# Altium project SVPXFMC_Carrier_6U.PrjPcb (part 6 of 9)

## Sheet CAN_IFC.SchDoc
size A3; Organization: Altium Limited; Address1: L3, 12a Rodborough Rd; Address2: Frenchs Forest; Address3: NSW; Address4: Australia 2086
Used 2 times, as channels FMC Carrier Channel1/U_CAN_IFC, FMC Carrier Channel2/U_CAN_IFC. Parts and nets are listed once, with the designators drawn on the sheet.
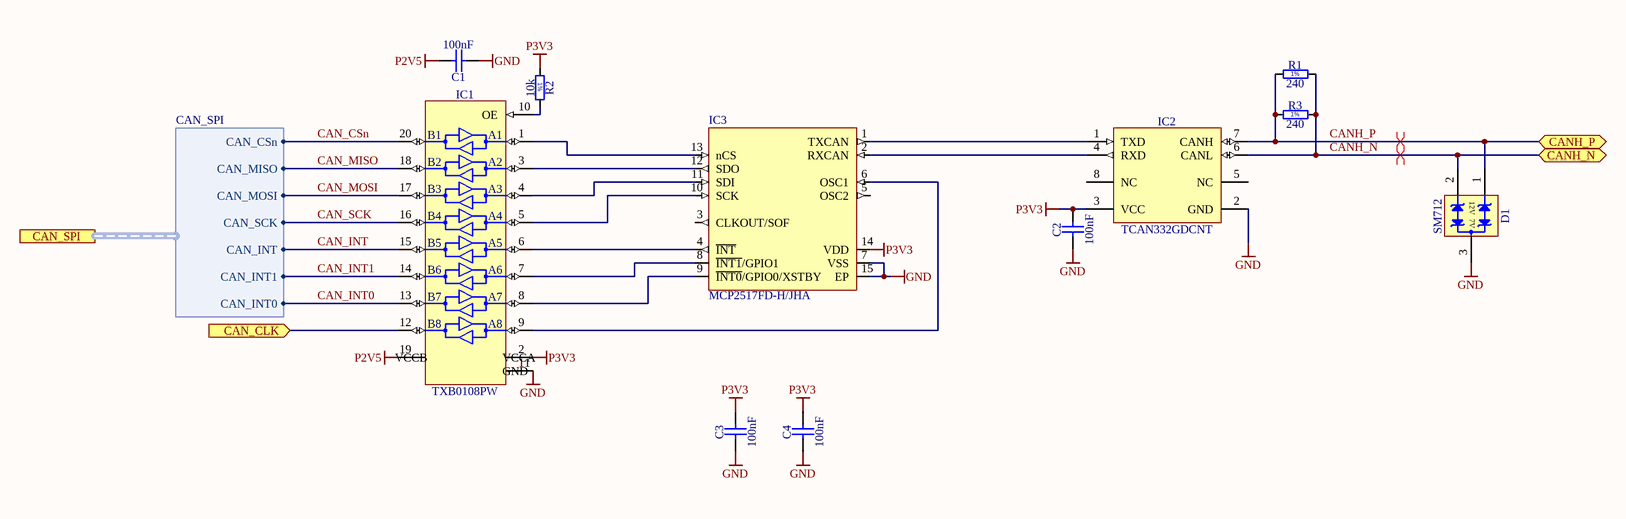
[diagram p16: CAN_IFC.SchDoc]

### Parts
C1  100nF  [CAPC1005X55N]
C2  100nF  [CAPC1005X55N]
C3  100nF  [CAPC1005X55N]
C4  100nF  [CAPC1005X55N]
D1  SM712  [SOT95P237X112-3N]
IC1  TXB0108PW  [SOP65P640X120-20N]
IC2  TCAN332GDCNT  [SOT65P280X145-8N]
IC3  MCP2517FD-H/JHA  [SON65P300X90_HS-15N]
R1  240  [RESC2012X60N]
R2  10k  [RESC1005X40N]
R3  240  [RESC2012X60N]

### Ports
CAN_CLK (in), CAN_SPI (harness CAN_SPI), CANH_N (bidir), CANH_P (bidir)

### Harnesses
CAN_SPI: CAN_INT1, CAN_INT, CAN_INT0, CAN_SCK, CAN_MOSI, CAN_MISO, CAN_CSn

### Nets
GND: C1.1 C2.1 C3.1 C4.1 D1.3(GND) IC1.11(GND) IC2.2(GND) IC3.7(VSS) IC3.15(EP)
P2V5: C1.2 IC1.19(Vccb)
P3V3: C2.2 C3.2 C4.2 IC1.2(Vcca) IC2.3(VCC) IC3.14(VDD) R2.1
CAN_CLK: IC1.12(B8) ; port CAN_CLK
CAN_CSn: IC1.20(B1) ; port CAN_SPI.CAN_CSn
CAN_INT: IC1.15(B5) ; port CAN_SPI.CAN_INT
CAN_INT0: IC1.13(B7) ; port CAN_SPI.CAN_INT0
CAN_INT1: IC1.14(B6) ; port CAN_SPI.CAN_INT1
CAN_MISO: IC1.18(B2) ; port CAN_SPI.CAN_MISO
CAN_MOSI: IC1.17(B3) ; port CAN_SPI.CAN_MOSI
CAN_SCK: IC1.16(B4) ; port CAN_SPI.CAN_SCK
CANH_N: D1.2(I/O2) IC2.6(CANL) R1.2 R3.2 ; port CANH_N
CANH_P: D1.1(I/O1) IC2.7(CANH) R1.1 R3.1 ; port CANH_P
NetIC1_1: IC1.1(A1) IC3.13(nCS)
NetIC1_3: IC1.3(A2) IC3.12(SDO)
NetIC1_4: IC1.4(A3) IC3.11(SDI)
NetIC1_5: IC1.5(A4) IC3.10(SCK)
NetIC1_6: IC1.6(A5) IC3.4(~{INT})
NetIC1_7: IC1.7(A6) IC3.8(~{INT1}/GPIO1)
NetIC1_8: IC1.8(A7) IC3.9(~{INT0}/GPIO0/XSTBY)
NetIC1_9: IC1.9(A8) IC3.6(OSC1)
NetIC1_10: IC1.10(OE) R2.2
NetIC2_1: IC2.1(TXD) IC3.1(TXCAN)
NetIC2_4: IC2.4(RXD) IC3.2(RXCAN)

Not connected (* = marked no-connect by the designer): IC2 5(NC) 8(NC); IC3 3(CLKOUT/SOF) 5(OSC2)

### Channels
FMC Carrier Channel1/U_CAN_IFC: designators end in A; ports CAN_CLK=NetIC1A_12 CANH_N=CANA_N CANH_P=CANA_P
FMC Carrier Channel2/U_CAN_IFC: designators end in B; ports CAN_CLK=NetIC1B_12 CANH_N=CANB_N CANH_P=CANB_P

### Layout directives
differential pair: CANA_N, CANA_P

### Notes on the sheet
- Title
- Size:
- Date:
- A3
- Number:
- Time:
- Revision:
- Sheet
- of
- File:
- (in symbol R0402_10K_1%_0.0625W_100PPM) 1%
- (in symbol R0805_240R_1%_0.125W_100PPM) 1%
- (in symbol SM712) 12V; 7V
- (in symbol TXB0108PW) VCCB; VCCA

### Library data of the parts
C1-C4 = CC0402_100NF_16V_10%_X5R: Non-polarised capacitor; Part Description: SMD Multilayer Chip Ceramic Capacitor; Manufacturer: GENERIC; Manufacturer1 Part Number: GRM155R61C104KA88D; Voltage: 16V; TC: X5R; Tolerance: ±10%; Part Number: CC0402_100NF_16V_10%_X5R; Component Kind: Standard; Component Type: Standard; Pin Count: 2; Value: 100nF; Status: None; Manufacturer Part Number: CC0402_100NF_16V_10%_X5R; Case: 0402; Mounted: Yes; Socket: No; SMD: Yes; Sense: No; Manufacturer1 Example: MURATA; Manufacturer1 ComponentHeight: 0.55mm; HelpURL: \\cern.ch\dfs\Applications\Altium\Datasheets\CC0402_X5R_MURATA_GRM.pdf; Author: CERN DEM JLC; CreateDate: 10.12.2013; LatestRevisionDate: 10.12.2013
D1 = SM712: Asymmetrical TVS Diode for Extended Common-Mode RS-485; Manufacturer: SEMTECH; Voltage: 12V/-7V; Power: 400W; PressFit: No; Bonding: No; Part Number: SM712; Component Kind: Standard; Component Type: Standard; Device: SM712; PackageDescription: SOT, 0.95mm, pitch; 3 pin,1.30mm W X 2.92mm L X 1.12mm H body, IPC Medium Density; Status: Obsolete; Part Description: Asymmetrical TVS Diode for Extended Common-Mode RS-485; Manufacturer Part Number: SM712; Pin Count: 3; Case: SOT-23; Mounted: Yes; Socket: No; SMD: Yes; Sense: No; ComponentHeight: 1.12mm; HelpURL: \\cern.ch\dfs\Applications\Altium\Datasheets\SM712.pdf; Author: CERN DEM JLC; CreateDate: 23/04/2012; LatestRevisionDate: 23/04/2012
IC1 = TXB0108PW: 8-Bit Bidirectional Voltage-Level Translator with Automatic Direction Sensing and ±15kV ESD Protection; Manufacturer: TEXAS INSTRUMENTS; PressFit: No; Bonding: No; Part Number: TXB0108PW; Component Kind: Standard; Component Type: Standard; Device: TXB0108PW; PackageDescription: SOP, 20-Leads, Body 6.5x4.4mm, Pitch 0.65mm, IPC Medium Density; Part Description: 8-Bit Bidirectional Voltage-Level Translator with Automatic Direction Sensing and ±15kV ESD Protection; Manufacturer Part Number: TXB0108PW; Pin Count: 20; Case: TSSOP20; Mounted: Yes; Socket: No; SMD: Yes; Sense: No; ComponentHeight: 1.2mm; Author: CERN DEM MR; HelpURL: \\cern.ch\dfs\Applications\Altium\Datasheets\TXB0108PW.pdf; CreateDate: 01.04.2016; LatestRevisionDate: 01.04.2016
IC2 = TCAN332GDCNT: 3.3V CAN Transceivers with CAN FD (Flexible Data Rate); Manufacturer: TEXAS INSTRUMENTS; PressFit: No; Bonding: No; Part Number: TCAN332GDCNT; Component Kind: Standard; Component Type: Standard; Device: TCAN332GDCNT; PackageDescription: SOT, 0.65mm pitch; 8 pin, 1.625mm W X 2.90mm L X 1.45mm H body, IPC Medium Density; Part Description: 3.3V CAN Transceivers with CAN FD (Flexible Data Rate); Manufacturer Part Number: TCAN332GDCNT; Pin Count: 8; Case: SOT23-8; Mounted: Yes; Socket: No; SMD: Yes; Sense: No; ComponentHeight: 1.45mm; Author: CERN DEM JLC; HelpURL: \\cern.ch\dfs\Applications\Altium\Datasheets\TCAN332GDCNT.pdf; CreateDate: 22/08/2017; LatestRevisionDate: 22/08/2017
IC3 = IFC_MCP2517: External CAN FD Controller with SPI Interface; Manufacturer: Microchip; Case: VDFN14; Component Type: Standard; Device: MCP2517FD-H/JHA; Manufacturer Part Number: MCP2517FD-H/JHA; Mounted: Yes; PackageDescription: DFN, 14-Leads, Body 4.50x3.00mm, Pitch 0.65mm, Thermal Pad 4.20x1.60mm, IPC Medium Density; Part Description: External CAN FD Controller with SPI Interface; Part Number: MCP2517FD-H/JHA; Pin Count: 14; SMD: Yes
R1 R3 = R0805_240R_1%_0.125W_100PPM: Resistor - 1%; Part Description: General Purpose Thick Film Chip Resistor; Manufacturer: GENERIC; Manufacturer1 Part Number: NRC10F2400TRF; Power: 0.125W; TC: ±100ppm/°C; PressFit: No; Mounted: No; Part Number: R0805_240R_1%_0.125W_100PPM; Component Kind: Standard; Component Type: Standard; Pin Count: 2; Value: 240; Status: Preferred; Tolerance: ±1%; Manufacturer Part Number: R0805_240R_1%_0.125W_100PPM; Case: 0805; Sense: No; Socket: No; SMD: Yes; Manufacturer1 Example: NIC COMPONENT; Manufacturer1 ComponentHeight: 0.6mm; HelpURL: \\cern.ch\dfs\Applications\Altium\Datasheets\R0805_NIC_NRC.pdf; Author: CERN DEM JLC; CreateDate: 03.12.2007; LatestRevisionDate: 13.03.2008
R2 = R0402_10K_1%_0.0625W_100PPM: Resistor - 1%; Part Description: General Purpose Thick Film Chip Resistor; Manufacturer: GENERIC; Manufacturer1 Part Number: 232270671003L; TC: ±100ppm/°C; PressFit: No; Part Number: R0402_10K_1%_0.0625W_100PPM; Component Kind: Standard; Component Type: Standard; Pin Count: 2; Value: 10k; Status: Not Recommended; Power: 0.0625W; Tolerance: ±1%; Manufacturer Part Number: R0402_10K_1%_0.0625W_100PPM; Case: 0402; Mounted: Yes; Sense: No; Socket: No; SMD: Yes; Manufacturer1 Example: YAGEO PHYCOMP; Manufacturer1 ComponentHeight: 0.4mm; HelpURL: \\cern.ch\dfs\Applications\Altium\Datasheets\R0402_Phycomp_RC0402.pdf; Author: CERN DEM JLC; CreateDate: 03.12.2007; LatestRevisionDate: 17.10.2012

## Sheet HDN_Control_Data.SchDoc
size A4; Organization: Creotech Instruments; Address1: Gen. L. Okulickiego 7/9; Address2: 05-500 Piaseczno; Address3: Poland
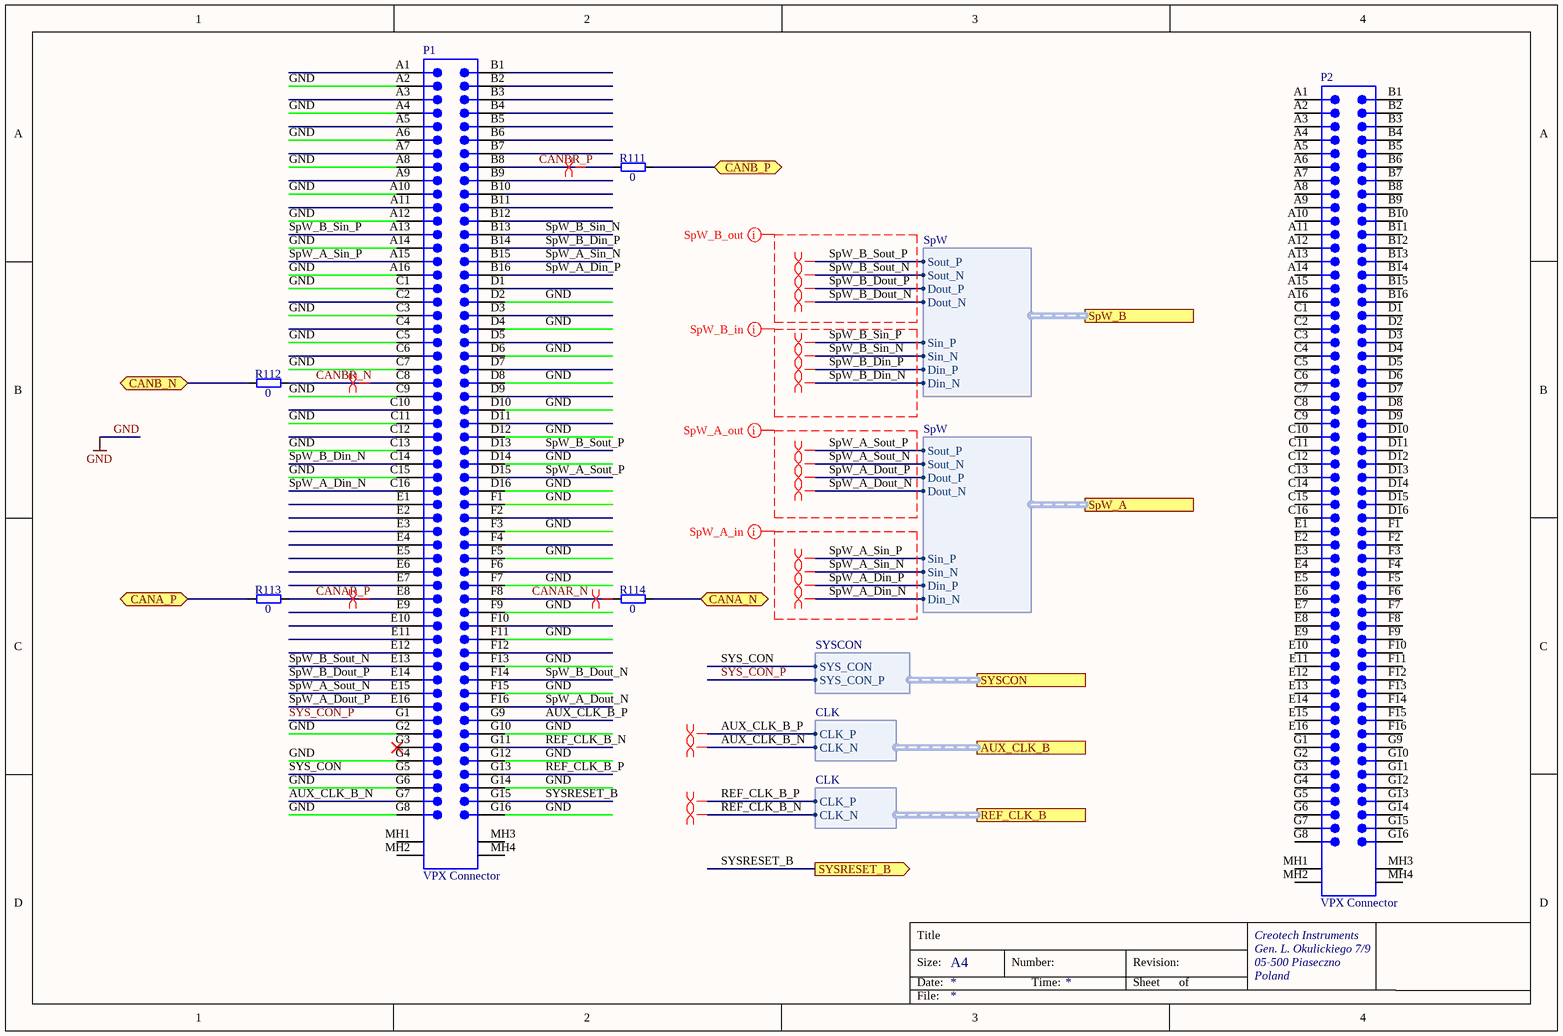
[diagram p17: HDN_Control_Data.SchDoc]

### Parts
P1  VPX Connector  [BTB1-8-4H112M]
P2  VPX Connector  [BTB1-8-4H112M]
R111  0  [RESC1608X55N]
R112  0  [RESC1608X55N]
R113  0  [RESC1608X55N]
R114  0  [RESC1608X55N]

### Ports
AUX_CLK_B (harness CLK), CANA_N (bidir), CANA_P (bidir), CANB_N (bidir), CANB_P (bidir), REF_CLK_B (harness CLK), SpW_A (harness SpW), SpW_B (harness SpW), SYSCON (harness SYSCON), SYSRESET_B (out)

### Harnesses
CLK: CLK_P, CLK_N
SYSCON: SYS_CON, SYS_CON_P
SpW: Sout_P, Sout_N, Dout_P, Dout_N, Sin_P, Sin_N, Din_P, Din_N

### Nets
GND: P1.A2 P1.A4 P1.A6 P1.A8 P1.A10 P1.A12 P1.A14 P1.A16 P1.C1 P1.C3 P1.C5 P1.C7 P1.C9 P1.C11 P1.C13 P1.C15 P1.D2 P1.D4 P1.D6 P1.D8 P1.D10 P1.D12 P1.D14 P1.D16 P1.F1 P1.F3 P1.F5 P1.F7 P1.F9 P1.F11 P1.F13 P1.F15 P1.G2 P1.G4 P1.G6 P1.G8 P1.G10 P1.G12 P1.G14 P1.G16
AUX_CLK_B_N: P1.G7 ; port AUX_CLK_B.CLK_N  [project net AUX_CLK_A_N]
AUX_CLK_B_P: P1.G9 ; port AUX_CLK_B.CLK_P  [project net AUX_CLK_A_P]
CANA_N: R114.2 ; port CANA_N
CANA_P: R113.1 ; port CANA_P
CANAR_N: P1.F8 R114.1
CANAR_P: P1.E8 R113.2
CANB_N: R112.1 ; port CANB_N
CANB_P: R111.2 ; port CANB_P
CANBR_N: P1.C8 R112.2
CANBR_P: P1.B8 R111.1
REF_CLK_B_N: P1.G11 ; port REF_CLK_B.CLK_N  [project net REF_CLK_A_N]
REF_CLK_B_P: P1.G13 ; port REF_CLK_B.CLK_P  [project net REF_CLK_A_P]
SpW_A_Din_N: P1.C16 ; port SpW_A.Din_N
SpW_A_Din_P: P1.B16 ; port SpW_A.Din_P
SpW_A_Dout_N: P1.F16 ; port SpW_A.Dout_N
SpW_A_Dout_P: P1.E16 ; port SpW_A.Dout_P
SpW_A_Sin_N: P1.B15 ; port SpW_A.Sin_N
SpW_A_Sin_P: P1.A15 ; port SpW_A.Sin_P
SpW_A_Sout_N: P1.E15 ; port SpW_A.Sout_N
SpW_A_Sout_P: P1.D15 ; port SpW_A.Sout_P
SpW_B_Din_N: P1.C14 ; port SpW_B.Din_N
SpW_B_Din_P: P1.B14 ; port SpW_B.Din_P
SpW_B_Dout_N: P1.F14 ; port SpW_B.Dout_N
SpW_B_Dout_P: P1.E14 ; port SpW_B.Dout_P
SpW_B_Sin_N: P1.B13 ; port SpW_B.Sin_N
SpW_B_Sin_P: P1.A13 ; port SpW_B.Sin_P
SpW_B_Sout_N: P1.E13 ; port SpW_B.Sout_N
SpW_B_Sout_P: P1.D13 ; port SpW_B.Sout_P
SYS_CON: P1.G5 ; port SYSCON.SYS_CON
SYS_CON_P: P1.G1 ; port SYSCON.SYS_CON_P
SYSRESET_B: P1.G15 ; port SYSRESET_B  [project net RST_B]

Not connected (* = marked no-connect by the designer): P1 A1 A3 A5 A7 A9 A11 B1 B2 B3 B4 B5 B6 B7 B9 B10 B11 B12 C2 C4 C6 C10 C12 D1 D3 D5 D7 D9 D11 E1 E2 E3 E4 E5 E6 E7 E9 E10 E11 E12 F2 F4 F6 F10 F12 G3* MH1 MH2 MH3 MH4; P2 A1 A2 A3 A4 A5 A6 A7 A8 A9 A10 A11 A12 A13 A14 A15 A16 B1 B2 B3 B4 B5 B6 B7 B8 B9 B10 B11 B12 B13 B14 B15 B16 C1 C2 C3 C4 C5 C6 C7 C8 C9 C10 C11 C12 C13 C14 C15 C16 D1 D2 D3 D4 D5 D6 D7 D8 D9 D10 D11 D12 D13 D14 D15 D16 E1 E2 E3 E4 E5 E6 E7 E8 E9 E10 E11 E12 E13 E14 E15 E16 F1 F2 F3 F4 F5 F6 F7 F8 F9 F10 F11 F12 F13 F14 F15 F16 G1 G2 G3 G4 G5 G6 G7 G8 G9 G10 G11 G12 G13 G14 G15 G16 MH1 MH2 MH3 MH4

### Layout directives
differential pair: AUX_CLK_A_N, AUX_CLK_A_P, CANAR_N, CANAR_P, CANBR_N, CANBR_P, REF_CLK_A_N, REF_CLK_A_P, SpW_A_Din_N, SpW_A_Din_P, SpW_A_Dout_N, SpW_A_Dout_P, SpW_A_Sin_N, SpW_A_Sin_P, SpW_A_Sout_N, SpW_A_Sout_P, SpW_B_Din_N, SpW_B_Din_P, SpW_B_Dout_N, SpW_B_Dout_P, SpW_B_Sin_N, SpW_B_Sin_P, SpW_B_Sout_N, SpW_B_Sout_P
net class SpW_B_out: SpW_B_Dout_N, SpW_B_Dout_P, SpW_B_Sout_N, SpW_B_Sout_P
net class SpW_B_in: SpW_B_Din_N, SpW_B_Din_P, SpW_B_Sin_N, SpW_B_Sin_P
net class SpW_A_out: SpW_A_Dout_N, SpW_A_Dout_P, SpW_A_Sout_N, SpW_A_Sout_P
net class SpW_A_in: SpW_A_Din_N, SpW_A_Din_P, SpW_A_Sin_N, SpW_A_Sin_P

### Notes on the sheet
- Title
- Size:
- Date:
- A4
- Number:
- Time:
- Revision:
- Sheet
- of
- File:

### Library data of the parts
P1 P2 = CON_VPX_1410187-3: Board-to-Board Connector, Right Angle, 7-Row, Pitch 1.8mm, 112-Position; Manufacturer: TE; Bonding: No; ComponentHeigth: 14.7mm; PressFit: No; Case: *; Component Kind: Standard; Component Type: Standard; CreateDate: 2018-01-01; Device: *; Footprint: *; HelpURL: *; LatestRevisionDate: 2018-01-01; Manufacturer Part Number: 1410187-3; Mounted: Yes; PackageDescription: 1410187-3; Part Description: Board-to-Board Connector, Right Angle, 7-Row, Pitch 1.8mm, 112-Position; Part Number: 1410187-3; Pin Count: *; Sense: No; SMD: Yes; Socket: No; Family: VPX Connector
R111-R114 = R0603_0R_JUMPER: Resistor; Part Description: 1A (0.05R Max DC Resistance) Zero Ohm Jumper; Manufacturer: GENERIC; Manufacturer1 Part Number: NRC06Z0; PressFit: No; Mounted: No; Part Number: R0603_0R_JUMPER; Component Kind: Standard; Component Type: Standard; Pin Count: 2; Value: 0; Status: Preferred; Manufacturer Part Number: R0603_0R_JUMPER; Case: 0603; Sense: No; Socket: No; SMD: Yes; Manufacturer1 Example: NIC COMPONENT; Manufacturer1 ComponentHeight: 0.55mm; HelpURL: \\cern.ch\dfs\Applications\Altium\Datasheets\R0603_NIC_NRC.pdf; Author: CERN DEM JLC; CreateDate: 03.12.2007; LatestRevisionDate: 13.03.2008

## Sheet HDN_Management.SchDoc
size A4; Organization: Creotech Instruments; Address1: Gen. L. Okulickiego 7/9; Address2: 05-500 Piaseczno; Address3: Poland
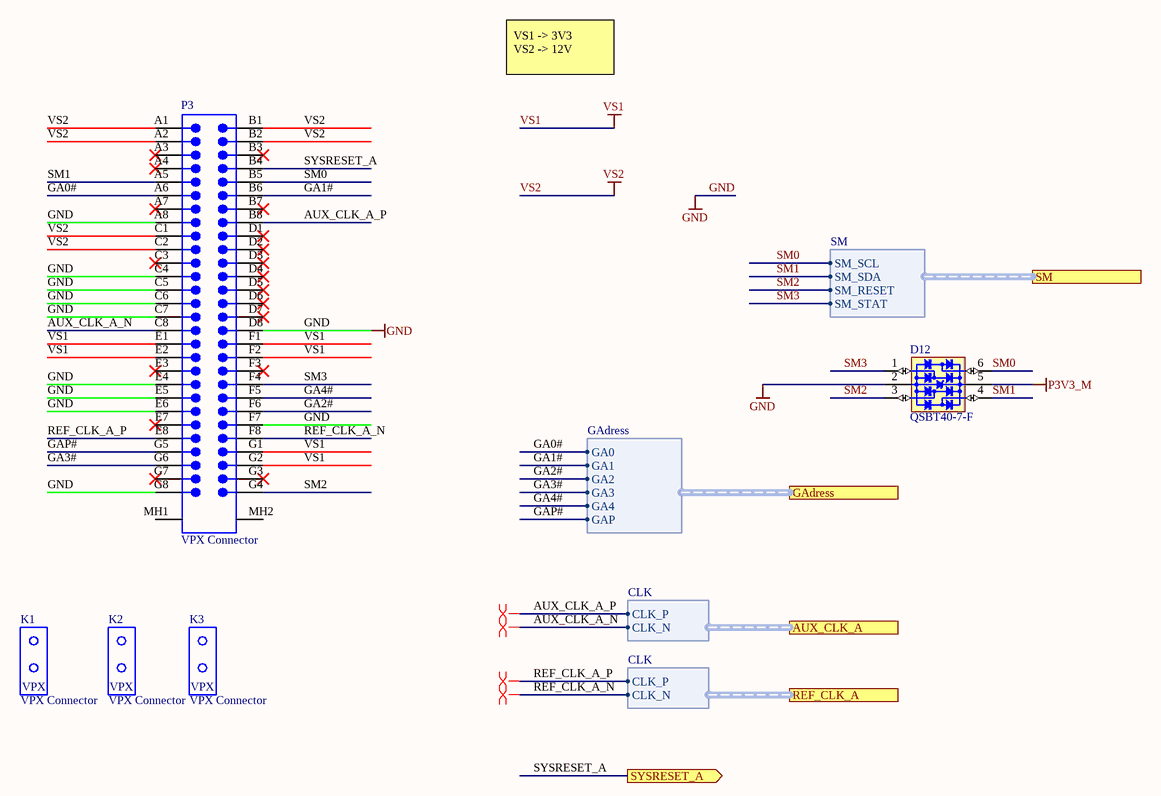
[diagram p18: HDN_Management.SchDoc]

### Parts
D12  QSBT40-7-F  [SOT65P210X110-6N]
K1  VPX Connector  [BTB5-5-2H2F]
K2  VPX Connector  [BTB5-5-2H2F]
K3  VPX Connector  [BTB5-5-2H2F]
P3  VPX Connector  [BTB1-8-2H56M]

### Ports
AUX_CLK_A (harness CLK), GAdress (harness GAdress), REF_CLK_A (harness CLK), SM (harness SM), SYSRESET_A (out)

### Harnesses
SM: SM_SCL, SM_SDA, SM_RESET, SM_STAT
GAdress: GA0, GA1, GA2, GA3, GA4, GAP
CLK: CLK_P, CLK_N

### Nets
GND: D12.2(GND) P3.A8 P3.C4 P3.C5 P3.C6 P3.C7 P3.D8 P3.E4 P3.E5 P3.E6 P3.F7 P3.G8
P3V3_M: D12.5(VBUS)
VS1: P3.E1 P3.E2 P3.F1 P3.F2 P3.G1 P3.G2
VS2: P3.A1 P3.A2 P3.B1 P3.B2 P3.C1 P3.C2
AUX_CLK_A_N: P3.C8 ; port AUX_CLK_A.CLK_N
AUX_CLK_A_P: P3.B8 ; port AUX_CLK_A.CLK_P
GA0#: P3.A6 ; port GAdress.GA0  [project net GA0]
GA1#: P3.B6 ; port GAdress.GA1  [project net GA1]
GA2#: P3.F6 ; port GAdress.GA2  [project net GA2]
GA3#: P3.G6 ; port GAdress.GA3  [project net GA3]
GA4#: P3.F5 ; port GAdress.GA4  [project net GA4]
GAP#: P3.G5 ; port GAdress.GAP  [project net GAP]
REF_CLK_A_N: P3.F8 ; port REF_CLK_A.CLK_N
REF_CLK_A_P: P3.E8 ; port REF_CLK_A.CLK_P
SM0: D12.6(I/O4) P3.B5 ; port SM.SM_SCL
SM1: D12.4(I/O3) P3.A5 ; port SM.SM_SDA
SM2: D12.3(I/O2) P3.G4 ; port SM.SM_RESET
SM3: D12.1(I/O1) P3.F4 ; port SM.SM_STAT
SYSRESET_A: P3.B4 ; port SYSRESET_A  [project net RST_A]

Not connected (* = marked no-connect by the designer): P3 A3* A4* A7* B3* B7* C3* D1* D2* D3* D4* D5* D6* D7* E3* E7* F3* G3* G7* MH1 MH2

### Layout directives
differential pair: AUX_CLK_A_N, AUX_CLK_A_P, REF_CLK_A_N, REF_CLK_A_P

### Notes on the sheet
- VS1 -> 3V3
  VS2 -> 12V
- Title
- Size:
- Date:
- A4
- Number:
- Time:
- Revision:
- Sheet
- of
- File:
- (in symbol CON_VPX_1469492-1) VPX

### Library data of the parts
D12 = D_TVS_QSBT40-7-F: Bonding: No; PressFit: No; Case: *; Component Kind: Standard; Component Type: Standard; ComponentHeigth: *; CreateDate: 2018-01-01; Device: QSBT40-7-F; Footprint: SOT363; HelpURL: *; LatestRevisionDate: 2018-01-01; Manufacturer: *; Manufacturer Part Number: QSBT40-7-F; Mounted: Yes; PackageDescription: *; Part Description: *; Part Number: *; Pin Count: 6; Sense: No; SMD: Yes; Socket: No; Value: *
K1-K3 = CON_VPX_1469492-1: VPX VITA 46 Alignment key, Right Angle, 1Key, Key orientation 0; Manufacturer: TE; Bonding: No; ComponentHeigth: 9.7mm; PressFit: No; Case: *; Component Kind: Standard; Component Type: Standard; CreateDate: 2018-01-01; Device: 1469492-1; Footprint: 1469492-1; HelpURL: *; LatestRevisionDate: 2018-01-01; Manufacturer Part Number: 1469492-1; Mounted: Yes; PackageDescription: *; Part Description: VPX VITA 46 Alignment key, Right Angle, 1Key, Key orientation 0; Part Number: 1469492-1; Pin Count: *; Sense: No; SMD: Yes; Socket: No; Family: VPX Connector
P3 = CON_VPX_1410189-3: Board-to-Board Connector, Right Angle, 7-Row, Pitch 1.8mm, 56-Position; Manufacturer: TE; Bonding: No; ComponentHeigth: 14.7mm; PressFit: No; Case: *; Component Kind: Standard; Component Type: Standard; CreateDate: 2018-01-01; Device: 1410189-3; Footprint: 1410189-3; HelpURL: *; LatestRevisionDate: 2018-01-01; Manufacturer Part Number: 1410189-3; Mounted: Yes; PackageDescription: *; Part Description: Board-to-Board Connector, Right Angle, 7-Row, Pitch 1.8mm, 56-Position; Part Number: *; Pin Count: *; Sense: No; SMD: Yes; Socket: No; Family: VPX Connector

## Sheet MSP_Telemetry.SchDoc
size A4; Organization: Creotech Instruments; Address1: Gen. L. Okulickiego 7/9; Address2: 05-500 Piaseczno; Address3: Poland
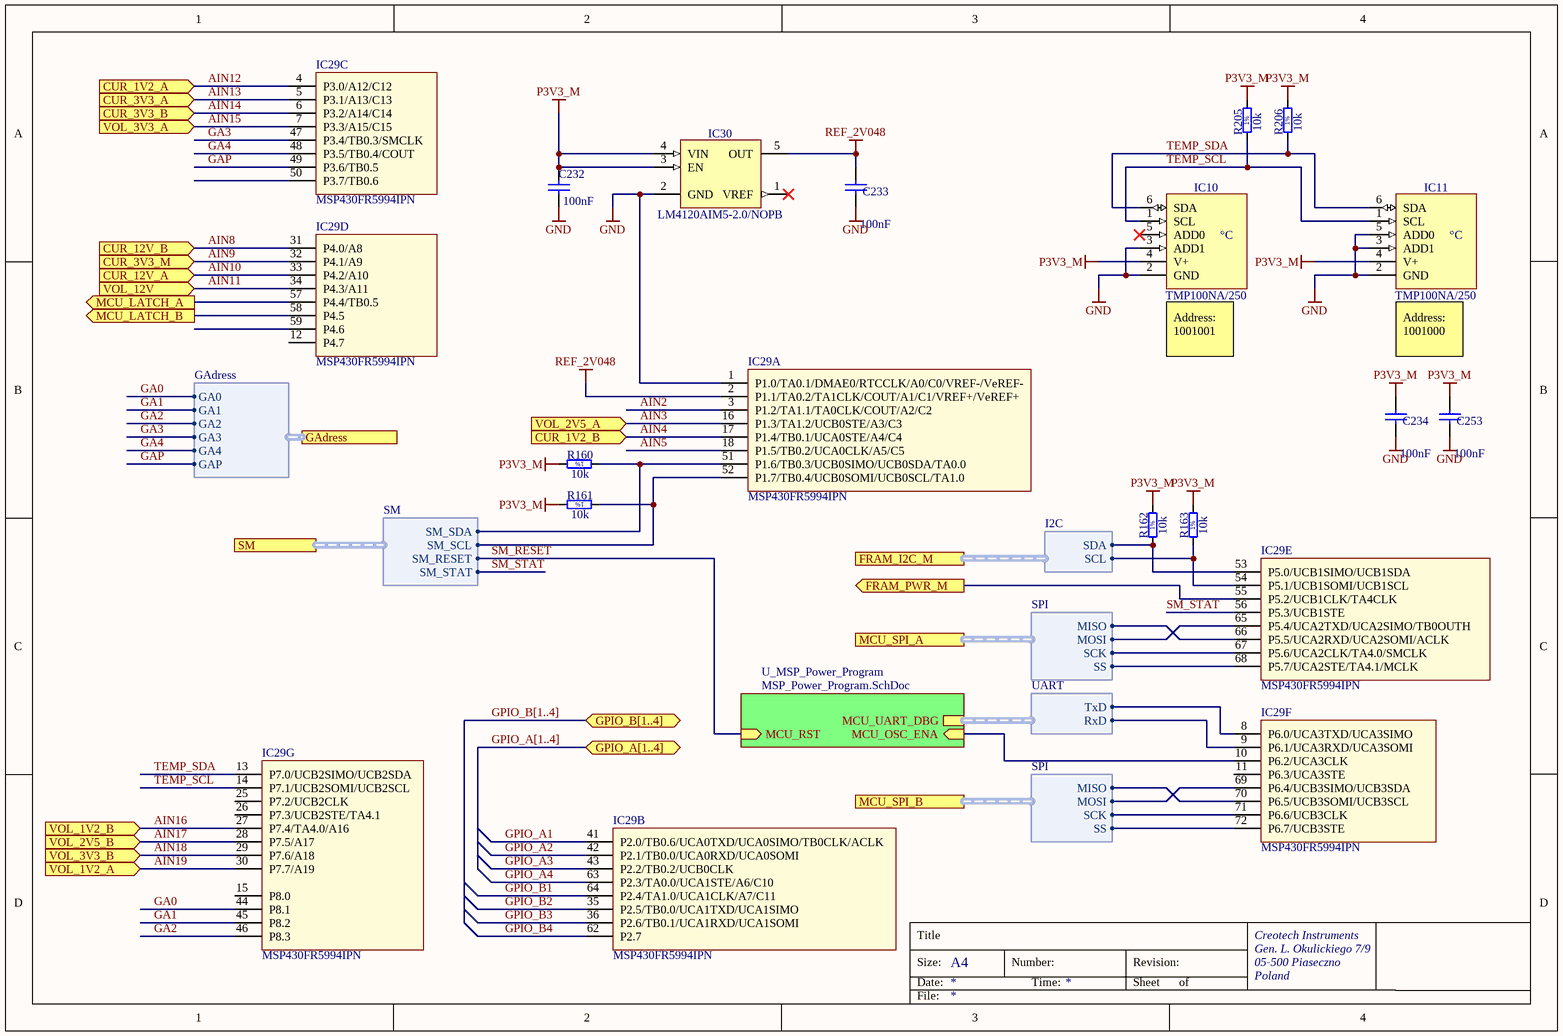
[diagram p19: MSP_Telemetry.SchDoc]

### Parts
C232  100nF  [CAPC1608X87N]
C233  100nF  [CAPC1608X87N]
C234  100nF  [CAPC1608X87N]
C253  100nF  [CAPC1608X87N]
IC10  TMP100NA/250  [SOT95P280X145-6N]
IC11  TMP100NA/250  [SOT95P280X145-6N]
IC29  MSP430FR5994IPN  [PQFP50P1400X1400-80N]  (parts A,B,C,D,E,F,G of 9)
IC30  LM4120AIM5-2.0/NOPB  [SOT95P280X145-5N]
R160  10k  [RESC1608X55N]
R161  10k  [RESC1608X55N]
R162  10k  [RESC1608X55N]
R163  10k  [RESC1608X55N]
R205  10k  [RESC1608X55N]
R206  10k  [RESC1608X55N]

### Sub-sheets
U_MSP_Power_Program = MSP_Power_Program.SchDoc: MCU_OSC_ENA (in), MCU_UART_DBG (harness UART), MCU_RST (in)

### Ports
CUR_1V2_A (in), CUR_1V2_B (in), CUR_3V3_A (in), CUR_3V3_B (in), CUR_3V3_M (in), CUR_12V_A (in), CUR_12V_B (in), FRAM_I2C_M (harness I2C), FRAM_PWR_M (out), GAdress (harness GAdress), GPIO_A[1..4] (bidir), GPIO_B[1..4] (bidir), MCU_LATCH_A (out), MCU_LATCH_B (out), MCU_SPI_A (harness SPI), MCU_SPI_B (harness SPI), SM (harness SM), VOL_1V2_A (in), VOL_1V2_B (in), VOL_2V5_A (in), VOL_2V5_B (in), VOL_3V3_A (in), VOL_3V3_B (in), VOL_12V (in)

### Harnesses
I2C: SDA, SCL
SPI: MISO, MOSI, SCK, SS
UART: TxD, RxD
SM: SM_SCL, SM_SDA, SM_RESET, SM_STAT
GAdress: GA0, GA1, GA2, GA3, GA4, GAP

### Nets
GND: C232.1 C233.1 C234.1 C253.1 IC10.2(GND) IC10.3(ADD1) IC11.2(GND) IC11.3(ADD1) IC11.5(ADD0) IC29.1(P1.0/TA0.1/DMAE0/RTCCLK/A0/C0/VREF-/VeREF-) IC30.2(GND)
P3V3_M: C232.2 C234.2 C253.2 IC10.4(V+) IC11.4(V+) IC30.3(EN) IC30.4(VIN) R160.2 R161.2 R162.2 R163.2 R205.2 R206.2
REF_2V048: C233.2 IC29.2(P1.1/TA0.2/TA1CLK/COUT/A1/C1/VREF+/VeREF+) IC30.5(OUT)
AIN2: IC29.3(P1.2/TA1.1/TA0CLK/COUT/A2/C2)
AIN3: IC29.16(P1.3/TA1.2/UCB0STE/A3/C3) ; port VOL_2V5_A
AIN4: IC29.17(P1.4/TB0.1/UCA0STE/A4/C4) ; port CUR_1V2_B
AIN5: IC29.18(P1.5/TB0.2/UCA0CLK/A5/C5)
AIN8: IC29.31(P4.0/A8) ; port CUR_12V_B
AIN9: IC29.32(P4.1/A9) ; port CUR_3V3_M
AIN10: IC29.33(P4.2/A10) ; port CUR_12V_A
AIN11: IC29.34(P4.3/A11) ; port VOL_12V
AIN12: IC29.4(P3.0/A12/C12) ; port CUR_1V2_A
AIN13: IC29.5(P3.1/A13/C13) ; port CUR_3V3_A
AIN14: IC29.6(P3.2/A14/C14) ; port CUR_3V3_B
AIN15: IC29.7(P3.3/A15/C15) ; port VOL_3V3_A
AIN16: IC29.27(P7.4/TA4.0/A16) ; port VOL_1V2_B
AIN17: IC29.28(P7.5/A17) ; port VOL_2V5_B
AIN18: IC29.29(P7.6/A18) ; port VOL_3V3_B
AIN19: IC29.30(P7.7/A19) ; port VOL_1V2_A
GA0: IC29.44(P8.1) ; port GAdress.GA0
GA1: IC29.45(P8.2) ; port GAdress.GA1
GA2: IC29.46(P8.3) ; port GAdress.GA2
GA3: IC29.47(P3.4/TB0.3/SMCLK) ; port GAdress.GA3
GA4: IC29.48(P3.5/TB0.4/COUT) ; port GAdress.GA4
GAP: IC29.49(P3.6/TB0.5) ; port GAdress.GAP
GPIO_A1: IC29.41(P2.0/TB0.6/UCA0TXD/UCA0SIMO/TB0CLK/ACLK)
GPIO_A2: IC29.42(P2.1/TB0.0/UCA0RXD/UCA0SOMI)
GPIO_A3: IC29.43(P2.2/TB0.2/UCB0CLK)
GPIO_A4: IC29.63(P2.3/TA0.0/UCA1STE/A6/C10)
GPIO_B1: IC29.64(P2.4/TA1.0/UCA1CLK/A7/C11)
GPIO_B2: IC29.35(P2.5/TB0.0/UCA1TXD/UCA1SIMO)
GPIO_B3: IC29.36(P2.6/TB0.1/UCA1RXD/UCA1SOMI)
GPIO_B4: IC29.62(P2.7)
RxD: IC29.9(P6.1/UCA3RXD/UCA3SOMI) ; sheet U_MSP_Power_Program/MCU_UART_DBG.RxD
SM0: IC29.52(P1.7/TB0.4/UCB0SOMI/UCB0SCL/TA1.0) R161.1 ; port SM.SM_SCL
SM1: IC29.51(P1.6/TB0.3/UCB0SIMO/UCB0SDA/TA0.0) R160.1 ; port SM.SM_SDA
SM_RESET: sheet U_MSP_Power_Program/MCU_RST, port SM.SM_RESET  [project net SM2]
SM_STAT: IC29.56(P5.3/UCB1STE) ; port SM.SM_STAT  [project net SM3]
TEMP_SCL: IC10.1(SCL) IC11.1(SCL) IC29.14(P7.1/UCB2SOMI/UCB2SCL) R205.1
TEMP_SDA: IC10.6(SDA) IC11.6(SDA) IC29.13(P7.0/UCB2SIMO/UCB2SDA) R206.1
TxD: IC29.8(P6.0/UCA3TXD/UCA3SIMO) ; sheet U_MSP_Power_Program/MCU_UART_DBG.TxD
NetD5_2: IC29.55(P5.2/UCB1CLK/TA4CLK) ; port FRAM_PWR_M
NetD10_1: IC29.53(P5.0/UCB1SIMO/UCB1SDA) R162.1 ; port FRAM_I2C_M.SDA
NetD11_1: IC29.54(P5.1/UCB1SOMI/UCB1SCL) R163.1 ; port FRAM_I2C_M.SCL
NetIC18A_2: IC29.65(P5.4/UCA2TXD/UCA2SIMO/TB0OUTH) ; port MCU_SPI_A.MOSI
NetIC18B_2: IC29.69(P6.4/UCB3SIMO/UCB3SDA) ; port MCU_SPI_B.MOSI
NetIC19A_2: IC29.67(P5.6/UCA2CLK/TA4.0/SMCLK) ; port MCU_SPI_A.SCK
NetIC19B_2: IC29.71(P6.6/UCB3CLK) ; port MCU_SPI_B.SCK
NetIC20A_2: IC29.68(P5.7/UCA2STE/TA4.1/MCLK) ; port MCU_SPI_A.SS
NetIC20B_2: IC29.72(P6.7/UCB3STE) ; port MCU_SPI_B.SS
NetIC26_1: IC29.10(P6.2/UCA3CLK) ; sheet U_MSP_Power_Program/MCU_OSC_ENA
NetIC29_57: IC29.57(P4.4/TB0.5) ; port MCU_LATCH_A
NetIC29_58: IC29.58(P4.5) ; port MCU_LATCH_B
NetIC29_66: IC29.66(P5.5/UCA2RXD/UCA2SOMI/ACLK) ; port MCU_SPI_A.MISO
NetIC29_70: IC29.70(P6.5/UCB3SOMI/UCB3SCL) ; port MCU_SPI_B.MISO

Not connected (* = marked no-connect by the designer): IC10 5(ADD0)*; IC29 11(P6.3/UCA3STE) 12(P4.7) 15(P8.0) 25(P7.2/UCB2CLK) 26(P7.3/UCB2STE/TA4.1) 50(P3.7/TB0.6) 59(P4.6); IC30 1(VREF)*

### Buses and harness runs
bus GPIO_A[1..4] = port GPIO_A[1..4]
bus GPIO_B[1..4] = port GPIO_B[1..4]

### Notes on the sheet
- (near IC10) Address: 1001001
- (near IC11) Address: 1001000
- Title
- Size:
- Date:
- A4
- Number:
- Time:
- Revision:
- Sheet
- of
- File:
- (in symbol R0603_10K_1%_0.1W_100PPM) 1%
- (in symbol TMP100NA/250) °C

### Library data of the parts
C232-C234 C253 = CC0603_100NF_50V_10%_X7R: Non-polarised capacitor; Part Description: SMD Multilayer Chip Ceramic Capacitor; Manufacturer: GENERIC; Manufacturer1 Part Number: 223858615649; Voltage: 50V; TC: X7R; Tolerance: ±10%; Part Number: CC0603_100NF_50V_10%_X7R; Component Kind: Standard; Component Type: Standard; Pin Count: 2; Value: 100nF; Status: Preferred; Manufacturer Part Number: CC0603_100NF_50V_10%_X7R; Case: 0603; Mounted: Yes; Socket: No; SMD: Yes; Sense: No; Manufacturer1 Example: PHYCOMP; Manufacturer1 ComponentHeight: 0.87mm; HelpURL: \\cern.ch\dfs\Applications\Altium\Datasheets\CC0603_X7R_PHYCOMP.pdf; Author: CERN DEM JLC; CreateDate: 2007-12-03; LatestRevisionDate: 2007-12-03
IC10 IC11 = TMP100NA/250: Digital Temperature Sensor with I2C Interface; Part Description: -55°C to +125°C, ±3.0°C Accuracy, Digital Temperature Sensor with I2C Interface; Manufacturer: TEXAS INSTRUMENTS; PressFit: No; Bonding: No; Part Number: TMP100NA/250; Component Kind: Standard; Component Type: Standard; Device: TMP100NA/250; PackageDescription: SOT23, 6-Leads, Body 1.6x3.0mm, Pitch 0.95mm, IPC Medium Density; Manufacturer Part Number: TMP100NA/250; Pin Count: 6; Case: SOT23-6; Mounted: Yes; Socket: No; SMD: Yes; Sense: No; ComponentHeight: 1.45mm; HelpURL: \\cern.ch\dfs\Applications\Altium\Datasheets\TMP100NA-250.pdf; Author: CERN DEM JLC; CreateDate: 29.10.2012; LatestRevisionDate: 29.10.2012
IC29 = UPC_MSP430FR5994IPN: Manufacturer: TI; Part Description: FRAM microcontroller; Bonding: No; ComponentHeigth: 2mm; PressFit: No; Case: LQFP80; Component Kind: Standard; Component Type: Standard; CreateDate: 2018-01-01; Device: MSP430FR5994IPN; Footprint: LQFP80; HelpURL: *; LatestRevisionDate: 2018-01-01; Manufacturer Part Number: MSP430FR5994IPN; Mounted: Yes; PackageDescription: LQFP80; Part Number: MSP430FR5994IPN; Pin Count: 80; Sense: No; SMD: Yes; Socket: No; Value: *
IC30 = LM4120AIM5-2.0/NOPB: Precision Micropower Low Dropout Voltage Reference; Part Description: 2.048V Precision Micropower Low Dropout Voltage Reference; Manufacturer: TEXAS INSTRUMENTS; PressFit: No; Bonding: No; Part Number: LM4120AIM5-2.0/NOPB; Component Kind: Standard; Component Type: Standard; Device: LM4120AIM5-2.0/NOPB; PackageDescription: SOT, 0.95mm Pitch; 5 Pin, 1.60mm W X 2.90mm L X 1.45mm H Body, IPC Medium Density; Manufacturer Part Number: LM4120AIM5-2.0/NOPB; Pin Count: 5; Case: SOT23-5; Mounted: Yes; Socket: No; SMD: Yes; Sense: No; ComponentHeight: 1.45mm; HelpURL: \\cern.ch\dfs\Applications\Altium\Datasheets\LM4120AIM5-2.0-NOPB.pdf; Author: CERN DEM JMW; CreateDate: 2016-08-31; LatestRevisionDate: 2016-08-31
R160-R163 R205 R206 = R0603_10K_1%_0.1W_100PPM: Resistor - 1%; Part Description: General Purpose Thick Film Chip Resistor; Manufacturer: GENERIC; Manufacturer1 Part Number: NRC06F1002TRF; Power: 0.1W; TC: ±100ppm/°C; PressFit: No; Part Number: R0603_10K_1%_0.1W_100PPM; Component Kind: Standard; Component Type: Standard; Pin Count: 2; Value: 10k; Status: Preferred; Tolerance: ±1%; Manufacturer Part Number: R0603_10K_1%_0.1W_100PPM; Case: 0603; Mounted: Yes; Sense: No; Socket: No; SMD: Yes; Manufacturer1 Example: NIC COMPONENT; Manufacturer1 ComponentHeight: 0.55mm; HelpURL: \\cern.ch\dfs\Applications\Altium\Datasheets\R0603_NIC_NRC.pdf; Author: CERN DEM JLC; CreateDate: 2007-12-03; LatestRevisionDate: 2008-03-13

## Sheet MSP_Power_Program.SchDoc
size A4; Organization: Creotech Instruments; Address1: Gen. L. Okulickiego 7/9; Address2: 05-500 Piaseczno; Address3: Poland
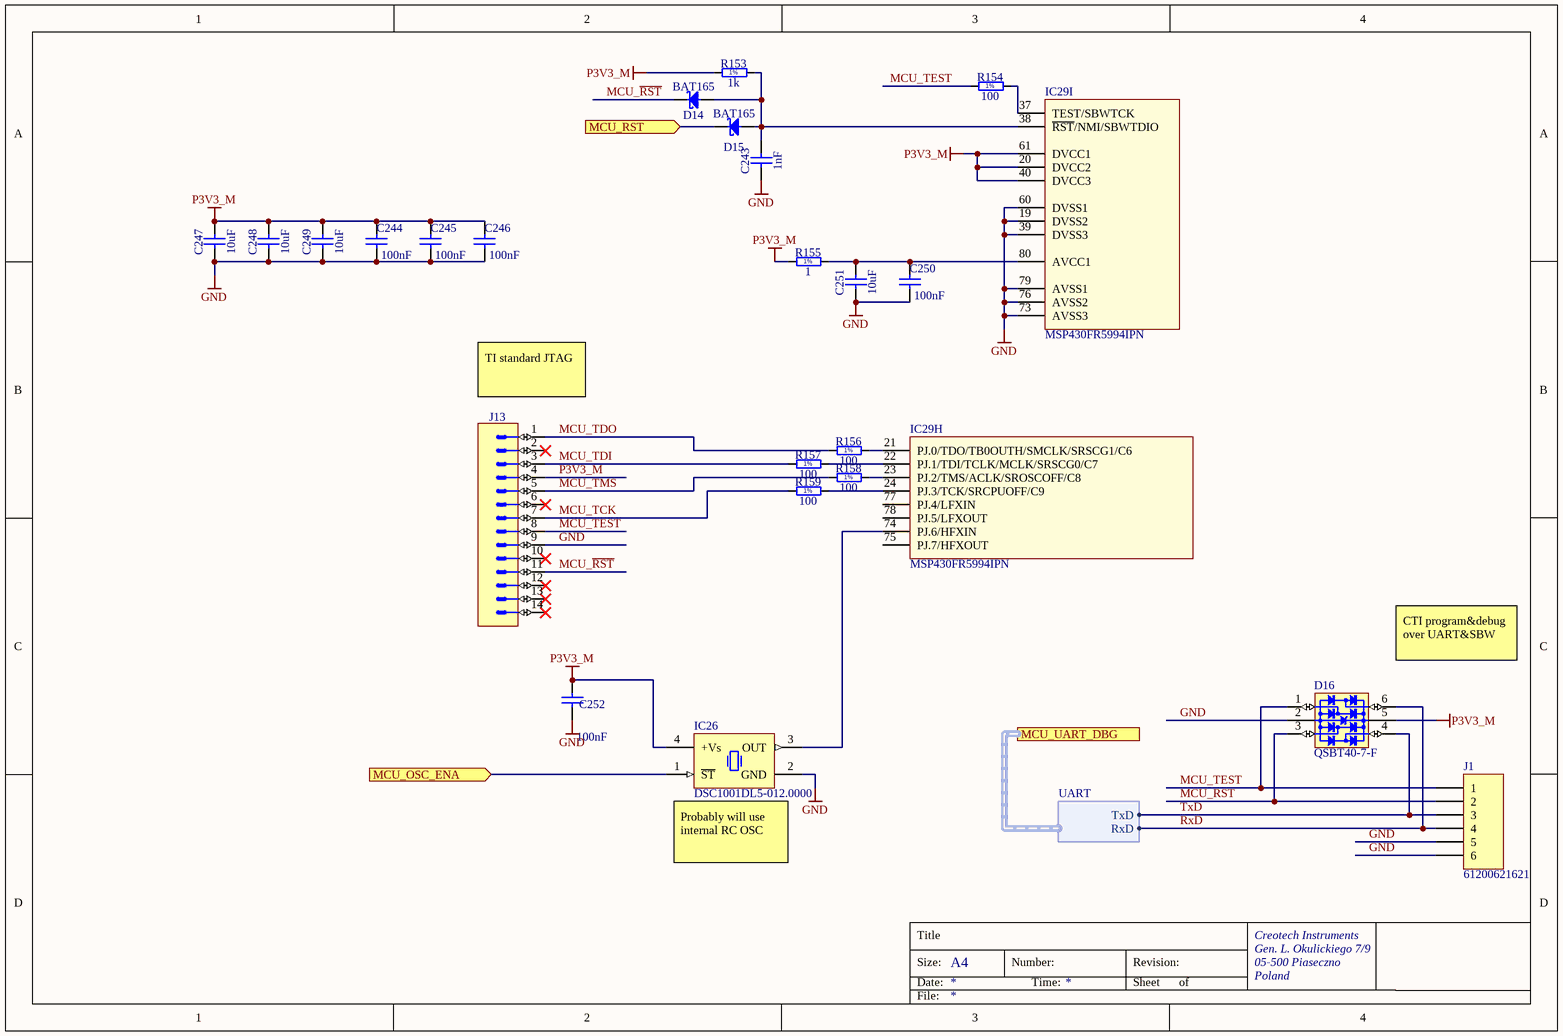
[diagram p20: MSP_Power_Program.SchDoc]

### Parts
C243  1nF  [CAPC1608X87N]
C244  100nF  [CAPC1608X87N]
C245  100nF  [CAPC1608X87N]
C246  100nF  [CAPC1608X87N]
C247  10uF  [CAPC1608X80N]
C248  10uF  [CAPC1608X80N]
C249  10uF  [CAPC1608X80N]
C250  100nF  [CAPC1608X87N]
C251  10uF  [CAPC1608X80N]
C252  100nF  [CAPC1608X87N]
D14  BAT165  [SOD2512X110N]
D15  BAT165  [SOD2512X110N]
D16  QSBT40-7-F  [SOT65P210X110-6N]
IC26  DSC1001DL5-012.0000  [OSC_MICREL_2520]
IC29  MSP430FR5994IPN  [PQFP50P1400X1400-80N]  (parts H,I of 9)
J1  61200621621  [61200621621]
J13  Header 14  [3M_N2514-6002RB]  (value not drawn)
R153  1k  [RESC1608X55N]
R154  100  [RESC1608X55N]
R155  1  [RESC1608X55N]
R156  100  [RESC1608X55N]
R157  100  [RESC1608X55N]
R158  100  [RESC1608X55N]
R159  100  [RESC1608X55N]

### Ports
MCU_OSC_ENA (in), MCU_RST (in), MCU_UART_DBG (harness UART)

### Harnesses
UART: TxD, RxD

### Nets
GND: C243.1 C244.1 C245.1 C246.1 C247.1 C248.1 C249.1 C250.1 C251.1 C252.1 D16.2(GND) IC26.2(GND) IC29.19(DVSS2) IC29.39(DVSS3) IC29.60(DVSS1) IC29.73(AVSS3) IC29.76(AVSS2) IC29.79(AVSS1) J1.5 J1.6 J13.9
P3V3_M: C244.2 C245.2 C246.2 C247.2 C248.2 C249.2 C252.2 D16.5(VBUS) IC26.4(+Vs) IC29.20(DVCC2) IC29.40(DVCC3) IC29.61(DVCC1) J13.4 R153.1 R155.1
MCU_~{RST}: D14.1(C) D16.3(I/O2) J1.2 J13.11
MCU_TCK: J13.7 R159.1
MCU_TDI: J13.3 R157.1
MCU_TDO: J13.1 R156.1
MCU_TEST: D16.1(I/O1) J1.1 J13.8 R154.1
MCU_TMS: J13.5 R158.1
RxD: D16.6(I/O4) J1.4 ; port MCU_UART_DBG.RxD
SM2: D15.1(C) ; port MCU_RST
TxD: D16.4(I/O3) J1.3 ; port MCU_UART_DBG.TxD
NetC243_2: C243.2 D14.2(A) D15.2(A) IC29.38(~{RST}/NMI/SBWTDIO) R153.2
NetC250_2: C250.2 C251.2 IC29.80(AVCC1) R155.2
NetIC26_1: IC26.1(~{ST}) ; port MCU_OSC_ENA
NetIC26_3: IC26.3(OUT) IC29.74(PJ.6/HFXIN)
NetIC29_21: IC29.21(PJ.0/TDO/TB0OUTH/SMCLK/SRSCG1/C6) R156.2
NetIC29_22: IC29.22(PJ.1/TDI/TCLK/MCLK/SRSCG0/C7) R157.2
NetIC29_23: IC29.23(PJ.2/TMS/ACLK/SROSCOFF/C8) R158.2
NetIC29_24: IC29.24(PJ.3/TCK/SRCPUOFF/C9) R159.2
NetIC29_37: IC29.37(TEST/SBWTCK) R154.2

Not connected (* = marked no-connect by the designer): IC29 75(PJ.7/HFXOUT) 77(PJ.4/LFXIN) 78(PJ.5/LFXOUT); J13 2* 6* 10* 12* 13* 14*

### Notes on the sheet
- (near J13) TI standard JTAG
- CTI program&debug over UART&SBW
- (near IC26) Probably will use internal RC OSC
- Title
- Size:
- Date:
- A4
- Number:
- Time:
- Revision:
- Sheet
- of
- File:
- (in symbol R0603_1K_1%_0.1W_100PPM) 1%
- (in symbol R0603_1R_1%_0.1W_200PPM) 1%
- (in symbol R0603_100R_1%_0.1W_100PPM) 1%

### Library data of the parts
C243 = CC0603_1NF_50V_10%_X7R: Non-polarised capacitor; Part Description: SMD Multilayer Chip Ceramic Capacitor; Manufacturer: GENERIC; Manufacturer1 Part Number: 223858615623; Voltage: 50V; TC: X7R; Tolerance: ±10%; Part Number: CC0603_1NF_50V_10%_X7R; Component Kind: Standard; Component Type: Standard; Pin Count: 2; Value: 1nF; Status: Preferred; Manufacturer Part Number: CC0603_1NF_50V_10%_X7R; Case: 0603; Mounted: Yes; Socket: No; SMD: Yes; Sense: No; Manufacturer1 Example: PHYCOMP; Manufacturer1 ComponentHeight: 0.87mm; HelpURL: \\cern.ch\dfs\Applications\Altium\Datasheets\CC0603_X7R_PHYCOMP.pdf; Author: CERN DEM JLC; CreateDate: 03.12.2007; LatestRevisionDate: 03.12.2007
C244-C246 C250 C252 = CC0603_100NF_50V_10%_X7R: as C232-C234 on sheet MSP_Telemetry; Part Number: CC0603_100NF_50V_10%_X7R; Component Kind: Standard; Component Type: Standard; Pin Count: 2; Value: 100nF; Status: Preferred; Manufacturer Part Number: CC0603_100NF_50V_10%_X7R; Case: 0603; Mounted: Yes; Socket: No; SMD: Yes; Sense: No; Manufacturer1 Example: PHYCOMP; Manufacturer1 ComponentHeight: 0.87mm; HelpURL: \\cern.ch\dfs\Applications\Altium\Datasheets\CC0603_X7R_PHYCOMP.pdf; Author: CERN DEM JLC; CreateDate: 2007-12-03; LatestRevisionDate: 2007-12-03
C247-C249 C251 = CC0603_10UF_16V_20%_X5R: Non-polarised capacitor; Part Description: SMD Multilayer Chip Ceramic Capacitor; Manufacturer: GENERIC; Manufacturer1 Part Number: GRM188R61C106MA73D; Voltage: 16V; TC: X5R; Tolerance: ±20%; Part Number: CC0603_10UF_16V_20%_X5R; Component Kind: Standard; Component Type: Standard; Pin Count: 2; Value: 10uF; Status: None; Manufacturer Part Number: CC0603_10UF_16V_20%_X5R; Case: 0603; Mounted: Yes; Socket: No; SMD: Yes; Sense: No; Manufacturer1 Example: MURATA; Manufacturer1 ComponentHeight: 0.8mm; HelpURL: \\cern.ch\dfs\Applications\Altium\Datasheets\CC0603_X5R_MURATA_GRM.pdf; Author: CERN DEM MR
  C247-C249: CreateDate: 02.03.2016; LatestRevisionDate: 02.03.2016
  C251: CreateDate: 2016-03-02; LatestRevisionDate: 2016-03-02
D14 D15 = BAT165: Schottky Diode; Part Description: Medium Power AF Schottky Diode; Manufacturer: INFINEON; Voltage: 40V; Power: 750mA; PressFit: No; Bonding: No; Part Number: BAT165; Component Kind: Standard; Component Type: Standard; Device: BAT165; PackageDescription: Small Outline Diode (SOD-323), 1.70mm W X 1.25mm L X 1.10mm H body,  IPC Medium Density; Manufacturer Part Number: BAT165; Pin Count: 2; Case: SOD323; Mounted: Yes; Socket: No; SMD: Yes; Sense: No; ComponentHeight: 1.1mm; HelpURL: \\cern.ch\dfs\Applications\Altium\Datasheets\BAT165.pdf; Author: CERN DEM JLC; CreateDate: 12.11.2014; LatestRevisionDate: 12.11.2014
D16 = D_TVS_QSBT40-7-F: Bonding: No; PressFit: No; Case: *; Component Kind: Standard; Component Type: Standard; ComponentHeigth: *; CreateDate: 2018-01-01; Device: QSBT40-7-F; Footprint: SOT363; HelpURL: *; LatestRevisionDate: 2018-01-01; Manufacturer: *; Manufacturer Part Number: QSBT40-7-F; Mounted: Yes; PackageDescription: *; Part Description: *; Part Number: *; Pin Count: 6; Sense: No; SMD: Yes; Socket: No; Value: *
IC26 = OSC_DSC1001DL5-012.0000: MEMS Oscillator 12MHz; Manufacturer: Micrel; Bonding: No; PressFit: No; Case: *; Component Kind: Standard; Component Type: Standard; ComponentHeigth: *; CreateDate: 2018-05-21; Device: DSC1001DL5-012.0000; Footprint: MICREL SMD Oscillator, QFN, 4 pins, 2.5mm x 2.0mm; HelpURL: *; LatestRevisionDate: 2018-05-21; Manufacturer Part Number: DSC1001DL5-012.0000; Mounted: Yes; PackageDescription: MICREL SMD Oscillator, QFN, 4 pins, 2.5mm x 2.0mm; Part Description: MEMS Oscillator 12MHz; Part Number: DSC1001DL5-012.0000; Pin Count: 4; Sense: No; SMD: Yes; Socket: No; Value: *
IC29 = UPC_MSP430FR5994IPN: as IC29 on sheet MSP_Telemetry; Case: LQFP80; Component Kind: Standard; Component Type: Standard; CreateDate: 2018-01-01; Device: MSP430FR5994IPN; Footprint: LQFP80; HelpURL: *; LatestRevisionDate: 2018-01-01; Manufacturer Part Number: MSP430FR5994IPN; Mounted: Yes; PackageDescription: LQFP80; Part Number: MSP430FR5994IPN; Pin Count: 80; Sense: No; SMD: Yes; Socket: No; Value: *
J1 = CON_IDC_6_61200621621: 6 pin male socket 2.54 IDC; Bonding: No; PressFit: No; Case: *; Component Kind: Standard; Component Type: Standard; ComponentHeigth: *; CreateDate: 2018-01-01; Device: 61200621621; HelpURL: *; LatestRevisionDate: 2018-01-01; Manufacturer: *; Manufacturer Part Number: 61200621621; Mounted: Yes; PackageDescription: *; Part Description: IDC; Part Number: 61200621621; Pin Count: 6; Sense: No; SMD: Yes; Socket: No; Value: 61200621621
J13 = 3M_N2514-6002RB: Connector 14 Male; Part Description: 14 Contacts - Straight .100'' x .100'' Low Profile Four-Wall Header, 2500 Series; Manufacturer: 3M; PressFit: No; Part Number: 3M_N2514-6002RB; Component Kind: Standard; Component Type: Standard; Pin Count: 14; Family: Header 14; Mounted: Yes; Socket: No; SMD: No; Sense: No; Status: None; Manufacturer Part Number: N2514-6002RB; ComponentHeight: 10.03mm; HelpURL: \\cern.ch\dfs\Applications\Altium\Datasheets\3M_N2514-6002RB.pdf; Author: CERN DEM JLC; CreateDate: 2009-02-11; LatestRevisionDate: 2009-08-11
R153 = R0603_1K_1%_0.1W_100PPM: Resistor - 1%; Part Description: General Purpose Thick Film Chip Resistor; Manufacturer: GENERIC; Manufacturer1 Part Number: NRC06F1001TRF; Power: 0.1W; TC: ±100ppm/°C; PressFit: No; Part Number: R0603_1K_1%_0.1W_100PPM; Component Kind: Standard; Component Type: Standard; Pin Count: 2; Value: 1k; Status: Preferred; Tolerance: ±1%; Manufacturer Part Number: R0603_1K_1%_0.1W_100PPM; Case: 0603; Mounted: Yes; Sense: No; Socket: No; SMD: Yes; Manufacturer1 Example: NIC COMPONENT; Manufacturer1 ComponentHeight: 0.55mm; HelpURL: \\cern.ch\dfs\Applications\Altium\Datasheets\R0603_NIC_NRC.pdf; Author: CERN DEM JLC; CreateDate: 03.12.2007; LatestRevisionDate: 13.03.2008
R154 R156-R159 = R0603_100R_1%_0.1W_100PPM: Resistor - 1%; Part Description: General Purpose Thick Film Chip Resistor; Manufacturer: GENERIC; Manufacturer1 Part Number: NRC06F4700TRF; Power: 0.1W; TC: ±100ppm/°C; PressFit: No; Part Number: R0603_100R_1%_0.1W_100PPM; Component Kind: Standard; Component Type: Standard; Pin Count: 2; Value: 100; Status: Preferred; Tolerance: ±1%; Manufacturer Part Number: R0603_100R_1%_0.1W_100PPM; Case: 0603; Mounted: Yes; Sense: No; Socket: No; SMD: Yes; Manufacturer1 Example: NIC COMPONENT; Manufacturer1 ComponentHeight: 0.55mm; HelpURL: \\cern.ch\dfs\Applications\Altium\Datasheets\R0603_NIC_NRC.pdf; Author: CERN DEM JLC; CreateDate: 2007-12-03; LatestRevisionDate: 2008-03-13
R155 = R0603_1R_1%_0.1W_200PPM: Resistor - 1%; Part Description: General Purpose Thick Film Chip Resistor; Manufacturer: GENERIC; Manufacturer1 Part Number: 232270461008L or RC0603FR-071RL; Power: 0.1W; TC: ±200ppm/°C; PressFit: No; Part Number: R0603_1R_1%_0.1W_200PPM; Component Kind: Standard; Component Type: Standard; Pin Count: 2; Value: 1; Status: Preferred; Tolerance: ±1%; Manufacturer Part Number: R0603_1R_1%_0.1W_200PPM; Case: 0603; Mounted: Yes; Sense: No; Socket: No; SMD: Yes; Manufacturer1 Example: YAGEO PHYCOMP; Manufacturer1 ComponentHeight: 0.65mm; HelpURL: \\cern.ch\dfs\Applications\Altium\Datasheets\R0603_Phycomp_RC0603.pdf; Author: CERN DEM JLC; CreateDate: 2007-12-03; LatestRevisionDate: 2012-10-17

## Sheet Module_Supply.SchDoc
size A4

## Sheet FRAM_memory.SchDoc
size A4; Organization: Creotech Instruments; Address1: Gen. L. Okulickiego 7/9; Address2: 05-500 Piaseczno; Address3: Poland
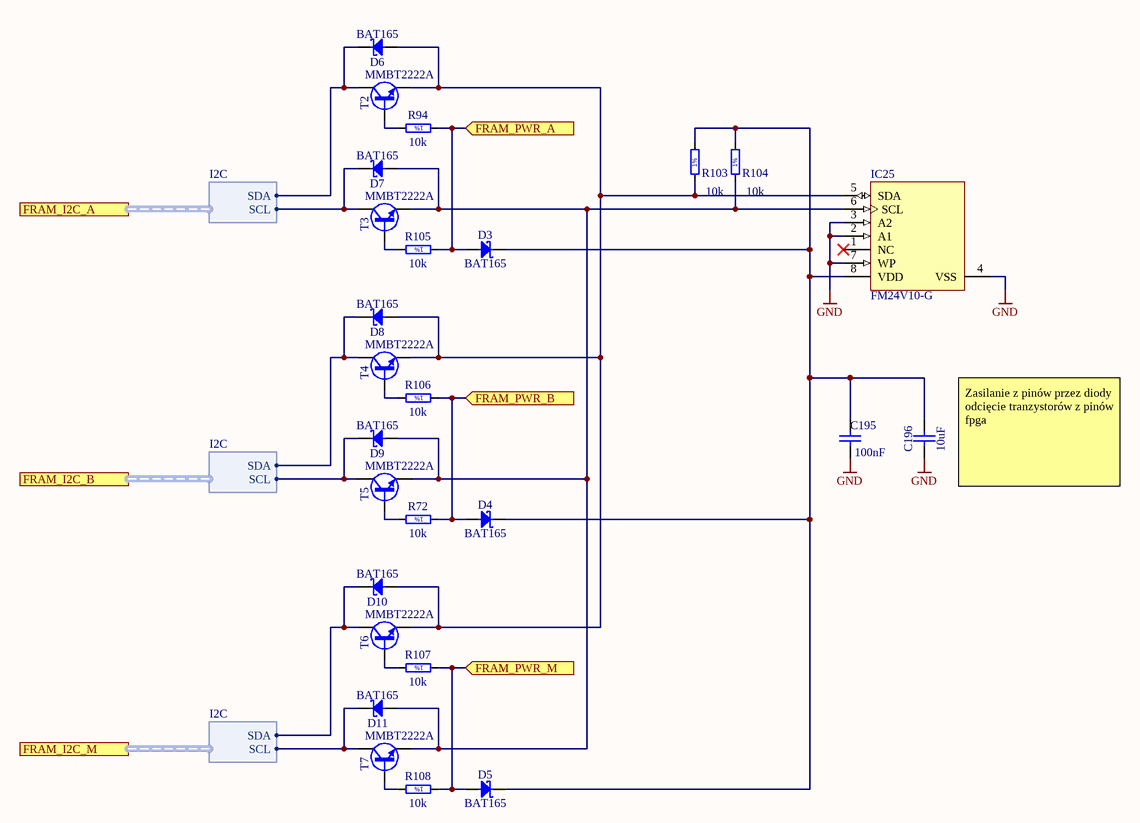
[diagram p21: FRAM_memory.SchDoc]

### Parts
C195  100nF  [CAPC1608X87N]
C196  10uF  [CAPC1608X80N]
D3  BAT165  [SOD2512X110N]
D4  BAT165  [SOD2512X110N]
D5  BAT165  [SOD2512X110N]
D6  BAT165  [SOD2512X110N]
D7  BAT165  [SOD2512X110N]
D8  BAT165  [SOD2512X110N]
D9  BAT165  [SOD2512X110N]
D10  BAT165  [SOD2512X110N]
D11  BAT165  [SOD2512X110N]
IC25  FM24V10-G  [SOIC127P600X175-8N]
R72  10k  [RESC1608X55N]
R94  10k  [RESC1608X55N]
R103  10k  [RESC1608X55N]
R104  10k  [RESC1608X55N]
R105  10k  [RESC1608X55N]
R106  10k  [RESC1608X55N]
R107  10k  [RESC1608X55N]
R108  10k  [RESC1608X55N]
T2  MMBT2222A  [SOT95P240X130-3N]
T3  MMBT2222A  [SOT95P240X130-3N]
T4  MMBT2222A  [SOT95P240X130-3N]
T5  MMBT2222A  [SOT95P240X130-3N]
T6  MMBT2222A  [SOT95P240X130-3N]
T7  MMBT2222A  [SOT95P240X130-3N]

### Ports
FRAM_I2C_A (harness I2C), FRAM_I2C_B (harness I2C), FRAM_I2C_M (harness I2C), FRAM_PWR_A (in), FRAM_PWR_B (in), FRAM_PWR_M (in)

### Harnesses
I2C: SDA, SCL

### Nets
GND: C195.1 C196.1 IC25.2(A1) IC25.3(A2) IC25.4(VSS) IC25.7(WP)
NetC195_2: C195.2 C196.2 D3.1(C) D4.1(C) D5.1(C) IC25.8(VDD) R103.2 R104.2
NetD3_2: D3.2(A) R94.1 R105.1 ; port FRAM_PWR_A
NetD4_2: D4.2(A) R72.1 R106.1 ; port FRAM_PWR_B
NetD5_2: D5.2(A) R107.1 R108.1 ; port FRAM_PWR_M
NetD6_1: D6.1(C) T2.3(C) ; port FRAM_I2C_A.SDA
NetD6_2: D6.2(A) D8.2(A) D10.2(A) IC25.5(SDA) R103.1 T2.2(E) T4.2(E) T6.2(E)
NetD7_1: D7.1(C) T3.3(C) ; port FRAM_I2C_A.SCL
NetD7_2: D7.2(A) D9.2(A) D11.2(A) IC25.6(SCL) R104.1 T3.2(E) T5.2(E) T7.2(E)
NetD8_1: D8.1(C) T4.3(C) ; port FRAM_I2C_B.SDA
NetD9_1: D9.1(C) T5.3(C) ; port FRAM_I2C_B.SCL
NetD10_1: D10.1(C) T6.3(C) ; port FRAM_I2C_M.SDA
NetD11_1: D11.1(C) T7.3(C) ; port FRAM_I2C_M.SCL
NetR72_2: R72.2 T5.1(B)
NetR94_2: R94.2 T2.1(B)
NetR105_2: R105.2 T3.1(B)
NetR106_2: R106.2 T4.1(B)
NetR107_2: R107.2 T6.1(B)
NetR108_2: R108.2 T7.1(B)

Not connected (* = marked no-connect by the designer): IC25 1(NC)*

### Notes on the sheet
- (near C196) Zasilanie z pinów przez diody
  odcięcie tranzystorów z pinów fpga
- Title
- Size:
- Date:
- A4
- Number:
- Time:
- Revision:
- Sheet
- of
- File:
- (in symbol R0603_10K_1%_0.1W_100PPM) 1%

### Library data of the parts
C195 = CC0603_100NF_50V_10%_X7R: as C232-C234 on sheet MSP_Telemetry; Part Number: CC0603_100NF_50V_10%_X7R; Component Kind: Standard; Component Type: Standard; Pin Count: 2; Value: 100nF; Status: Preferred; Manufacturer Part Number: CC0603_100NF_50V_10%_X7R; Case: 0603; Mounted: Yes; Socket: No; SMD: Yes; Sense: No; Manufacturer1 Example: PHYCOMP; Manufacturer1 ComponentHeight: 0.87mm; HelpURL: \\cern.ch\dfs\Applications\Altium\Datasheets\CC0603_X7R_PHYCOMP.pdf; Author: CERN DEM JLC; CreateDate: 2007-12-03; LatestRevisionDate: 2007-12-03
C196 = CC0603_10UF_16V_20%_X5R: as C247 on sheet MSP_Power_Program; Part Number: CC0603_10UF_16V_20%_X5R; Component Kind: Standard; Component Type: Standard; Pin Count: 2; Value: 10uF; Status: None; Manufacturer Part Number: CC0603_10UF_16V_20%_X5R; Case: 0603; Mounted: Yes; Socket: No; SMD: Yes; Sense: No; Manufacturer1 Example: MURATA; Manufacturer1 ComponentHeight: 0.8mm; HelpURL: \\cern.ch\dfs\Applications\Altium\Datasheets\CC0603_X5R_MURATA_GRM.pdf; Author: CERN DEM MR; CreateDate: 02.03.2016; LatestRevisionDate: 02.03.2016
D3-D11 = BAT165: as D14 on sheet MSP_Power_Program; Part Number: BAT165; Component Kind: Standard; Component Type: Standard; Device: BAT165; PackageDescription: Small Outline Diode Flat Lead (SOD-323), 1.70mm W X 1.25mm L X 1.10mm H body,  IPC Medium Density; Manufacturer Part Number: BAT165; Pin Count: 2; Case: SOD323; Mounted: Yes; Socket: No; SMD: Yes; Sense: No; ComponentHeight: 1.1mm; HelpURL: \\cern.ch\dfs\Applications\Altium\Datasheets\BAT165.pdf; Author: CERN DEM JLC; CreateDate: 2014-11-12; LatestRevisionDate: 2014-11-12
IC25 = MEM_FM24V10-G: Manufacturer: Cypress; Part Description: 1Mbit I2C FRAM; Bonding: No; PressFit: No; Case: *; Component Kind: Standard; Component Type: Standard; ComponentHeigth: *; CreateDate: 2018-01-01; Device: FM24V10-G; Footprint: *; HelpURL: *; LatestRevisionDate: 2018-01-01; Manufacturer Part Number: FM24V10-G; Mounted: Yes; PackageDescription: SO8; Part Number: FM24V10-G; Pin Count: 8; Sense: No; SMD: Yes; Socket: No; Value: *
R72 R94 R103-R108 = R0603_10K_1%_0.1W_100PPM: as R160-R163 on sheet MSP_Telemetry; Part Number: R0603_10K_1%_0.1W_100PPM; Component Kind: Standard; Component Type: Standard; Pin Count: 2; Value: 10k; Status: Preferred; Tolerance: ±1%; Manufacturer Part Number: R0603_10K_1%_0.1W_100PPM; Case: 0603; Mounted: Yes; Sense: No; Socket: No; SMD: Yes; Manufacturer1 Example: NIC COMPONENT; Manufacturer1 ComponentHeight: 0.55mm; HelpURL: \\cern.ch\dfs\Applications\Altium\Datasheets\R0603_NIC_NRC.pdf; Author: CERN DEM JLC; CreateDate: 2007-12-03; LatestRevisionDate: 2008-03-13
T2-T7 = MMBT2222A: NPN Transistor; Part Description: 40V 1A NPN General Purpose Amplifier; Manufacturer: FAIRCHILD SEMICONDUCTOR; PressFit: No; Bonding: No; Part Number: MMBT2222A; Component Kind: Standard; Component Type: Standard; Device: MMBT2222A; PackageDescription: SOT23 3-Leads, Pitch 0.95mm - Body 1.4x3mm, IPC Medium Density; Manufacturer Part Number: MMBT2222A; Pin Count: 3; Case: SOT23-3; Mounted: Yes; Socket: No; SMD: Yes; Sense: No; ComponentHeight: 1.3mm; HelpURL: \\cern.ch\dfs\Applications\Altium\Datasheets\MJD45H11G.pdf; Author: CERN DEM JLC; CreateDate: 2009-05-04; LatestRevisionDate: 2009-05-04